# EAGLE design ssr8ch (EAGLE 9.3.0)
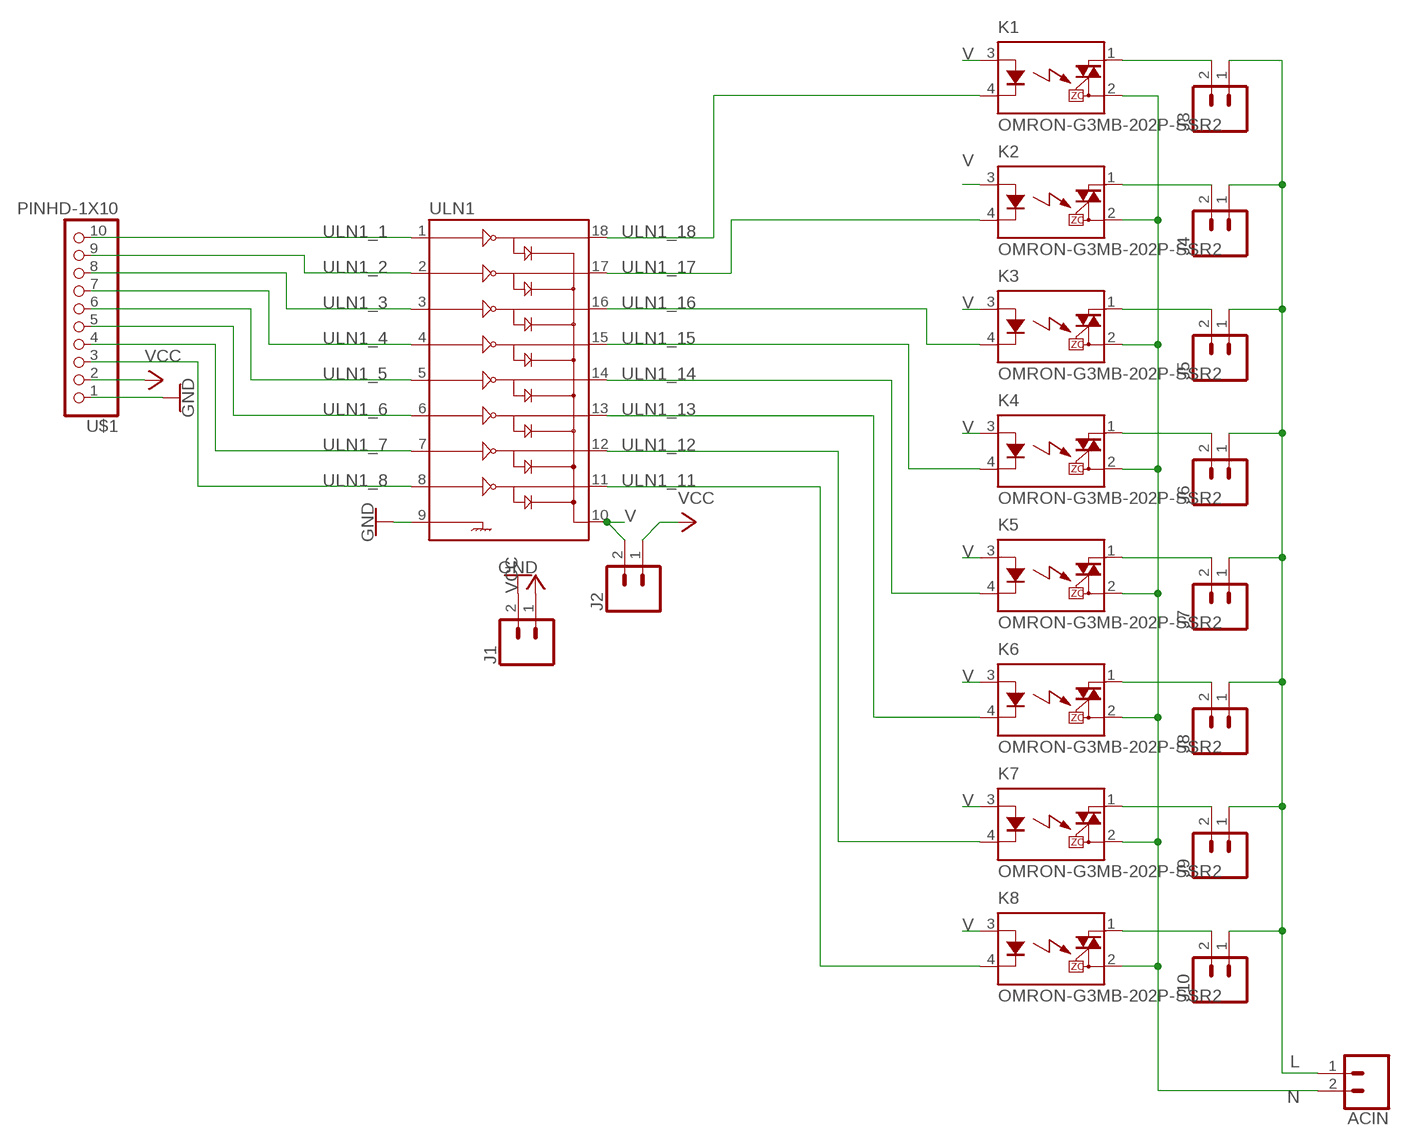
[diagram p0: schematic, sheet 1]

## Parts
ACIN  CONN_025MM  [SCREWTERMINAL-5MM-2]
J1  CONN_025MM  [SCREWTERMINAL-5MM-2]
J2  CONN_021X02_NO_SILK  [1X02_NO_SILK]
J3  CONN_025MM  [SCREWTERMINAL-5MM-2]
J4  CONN_025MM  [SCREWTERMINAL-5MM-2]
J5  CONN_025MM  [SCREWTERMINAL-5MM-2]
J6  CONN_025MM  [SCREWTERMINAL-5MM-2]
J7  CONN_025MM  [SCREWTERMINAL-5MM-2]
J8  CONN_025MM  [SCREWTERMINAL-5MM-2]
J9  CONN_025MM  [SCREWTERMINAL-5MM-2]
J10  CONN_025MM  [SCREWTERMINAL-5MM-2]
K1  OMRON-G3MB-202P-SSR2  [OMRON-G3MB-202P-SSR]
K2  OMRON-G3MB-202P-SSR2  [OMRON-G3MB-202P-SSR]
K3  OMRON-G3MB-202P-SSR2  [OMRON-G3MB-202P-SSR]
K4  OMRON-G3MB-202P-SSR2  [OMRON-G3MB-202P-SSR]
K5  OMRON-G3MB-202P-SSR2  [OMRON-G3MB-202P-SSR]
K6  OMRON-G3MB-202P-SSR2  [OMRON-G3MB-202P-SSR]
K7  OMRON-G3MB-202P-SSR2  [OMRON-G3MB-202P-SSR]
K8  OMRON-G3MB-202P-SSR2  [OMRON-G3MB-202P-SSR]
U$1  PINHD-1X10  [1X10-BIG]
ULN1  ULN2803DIP  [DIL18]

## Nets
GND: J1.2 U$1.1 ULN1.9
L: ACIN.1 J3.1 J4.1 J5.1 J6.1 J7.1 J8.1 J9.1 J10.1
N: ACIN.2 K1.2(DS2) K2.2(DS2) K3.2(DS2) K4.2(DS2) K5.2(DS2) K6.2(DS2) K7.2(DS2) K8.2(DS2)
N$2: J3.2 K1.1(DS1)
N$4: J5.2 K3.1(DS1)
N$5: J6.2 K4.1(DS1)
N$6: J7.2 K5.1(DS1)
N$7: J8.2 K6.1(DS1)
N$8: J9.2 K7.1(DS1)
N$9: J10.2 K8.1(DS1)
N$11: J4.2 K2.1(DS1)
ULN1_1: U$1.10 ULN1.1
ULN1_2: U$1.9 ULN1.2
ULN1_3: U$1.8 ULN1.3
ULN1_4: U$1.7 ULN1.4
ULN1_5: U$1.6 ULN1.5
ULN1_6: U$1.5 ULN1.6
ULN1_7: U$1.4 ULN1.7
ULN1_8: U$1.3 ULN1.8
ULN1_11: K8.4(K) ULN1.11
ULN1_12: K7.4(K) ULN1.12
ULN1_13: K6.4(K) ULN1.13
ULN1_14: K5.4(K) ULN1.14
ULN1_15: K4.4(K) ULN1.15
ULN1_16: K3.4(K) ULN1.16
ULN1_17: K2.4(K) ULN1.17
ULN1_18: K1.4(K) ULN1.18
V: J2.2 K1.3(A) K2.3(A) K3.3(A) K4.3(A) K5.3(A) K6.3(A) K7.3(A) K8.3(A) ULN1.10
VCC: J1.1 J2.1 U$1.2

## Library data of the parts
ACIN J1 J3-J10 = ssr8ch:CONN_02: Multi connection point. Often used as Generic Header-pin footprint for 0.1 inch spaced/style header connections On any of the 0.1 inch spaced packages, you can populate with these: Break Away Headers - Straight <https://www.sparkfun.com/products/116> (PRT-00116) Break Away Male Headers - Right Angle <https://www.sparkfun.com/products/553> (PRT-00553) Female Headers <https://www.sparkfun.com/products/115> (PRT-00115) Break Away Headers - Machine Pin <https://www.sparkfun.com/products/117> (PRT-00117) Break Away Female Headers - Swiss Machine Pin <https://www.sparkfun.com/products/743> (PRT-00743) For SCREWTERMINALS and SPRING TERMINALS visit here: Screw Terimnals on SparkFun.com <https://www.sparkfun.com/search/results?term=Screw+Terminals> (5mm/3.5mm/2.54mm spacing) This device is also useful as a general connection point to wire up your design to another part of your project. Our various solder wires solder well into these plated through hole pads. Hook-Up Wire - Assortment (Stranded, 22 AWG) <https://www.sparkfun.com/products/11375> (PRT-11375) Hook-Up Wire - Assortment (Solid Core, 22 AWG) <https://www.sparkfun.com/products/11367> (PRT-11367) View the entire wire category on our website here <https://www.sparkfun.com/categories/141> Special notes: Molex polarized connector foot print use with: PRT-08233 with associated crimp pins and housings. 2.54_SCREWTERM for use with PRT-10571. 3.5mm Screw Terminal footprints for PRT-08084 5mm Screw Terminal footprints for use with PRT-08432; SF_SKU: PRT-08432
J2 = ssr8ch:CONN_02: Multi connection point. Often used as Generic Header-pin footprint for 0.1 inch spaced/style header connections On any of the 0.1 inch spaced packages, you can populate with these: Break Away Headers - Straight <https://www.sparkfun.com/products/116> (PRT-00116) Break Away Male Headers - Right Angle <https://www.sparkfun.com/products/553> (PRT-00553) Female Headers <https://www.sparkfun.com/products/115> (PRT-00115) Break Away Headers - Machine Pin <https://www.sparkfun.com/products/117> (PRT-00117) Break Away Female Headers - Swiss Machine Pin <https://www.sparkfun.com/products/743> (PRT-00743) For SCREWTERMINALS and SPRING TERMINALS visit here: Screw Terimnals on SparkFun.com <https://www.sparkfun.com/search/results?term=Screw+Terminals> (5mm/3.5mm/2.54mm spacing) This device is also useful as a general connection point to wire up your design to another part of your project. Our various solder wires solder well into these plated through hole pads. Hook-Up Wire - Assortment (Stranded, 22 AWG) <https://www.sparkfun.com/products/11375> (PRT-11375) Hook-Up Wire - Assortment (Solid Core, 22 AWG) <https://www.sparkfun.com/products/11367> (PRT-11367) View the entire wire category on our website here <https://www.sparkfun.com/categories/141> Special notes: Molex polarized connector foot print use with: PRT-08233 with associated crimp pins and housings. 2.54_SCREWTERM for use with PRT-10571. 3.5mm Screw Terminal footprints for PRT-08084 5mm Screw Terminal footprints for use with PRT-08432
K1-K8 = ssr8ch:OMRON-G3MB-202P-SSR: IT(rms) 8A, Zero Cross type SIP 4pin Triac output SSR Source: http://sharp-world.com/products/device/lineup/data/pdf/datasheet/s102s02_e.pdf; MPN: S202S02F; OC_FARNELL: 1618475; OC_NEWARK: 14N9588
U$1 = ssr8ch:PINHD-1X10: Pin header 1x10 0.1" spacing With round pins
ULN1 = ssr8ch:ULN2803: Darlington Driver(IC-07959, low stock) ULN2803 Darlington array. 500mA max per channel, 8-channel package. Spark Fun Electronics SKU : COM-00312

## Net classes
0 default: clearance 0.9 mm

## Board
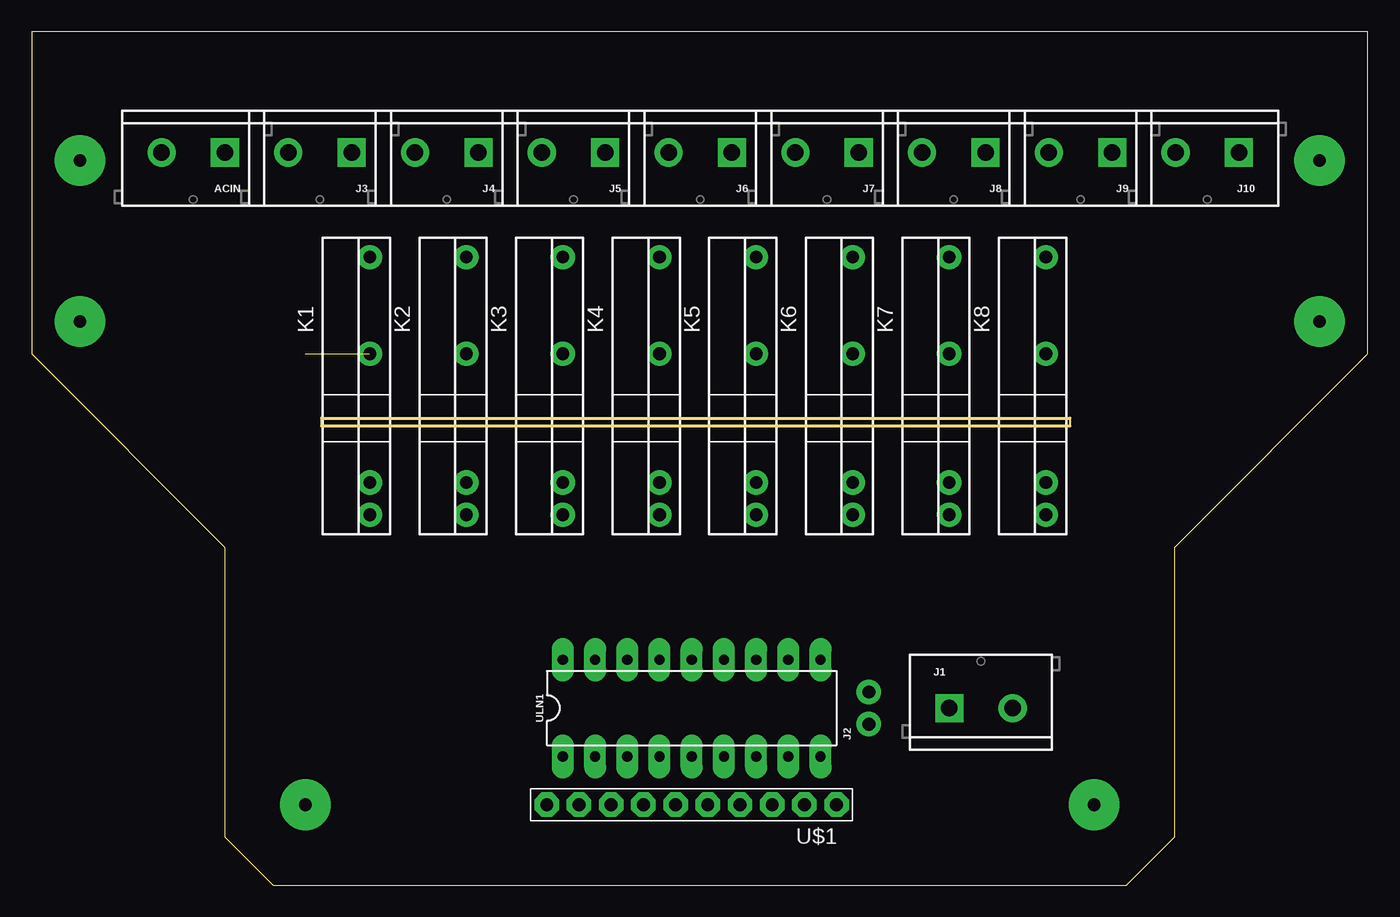
[diagram p1: board, top side]
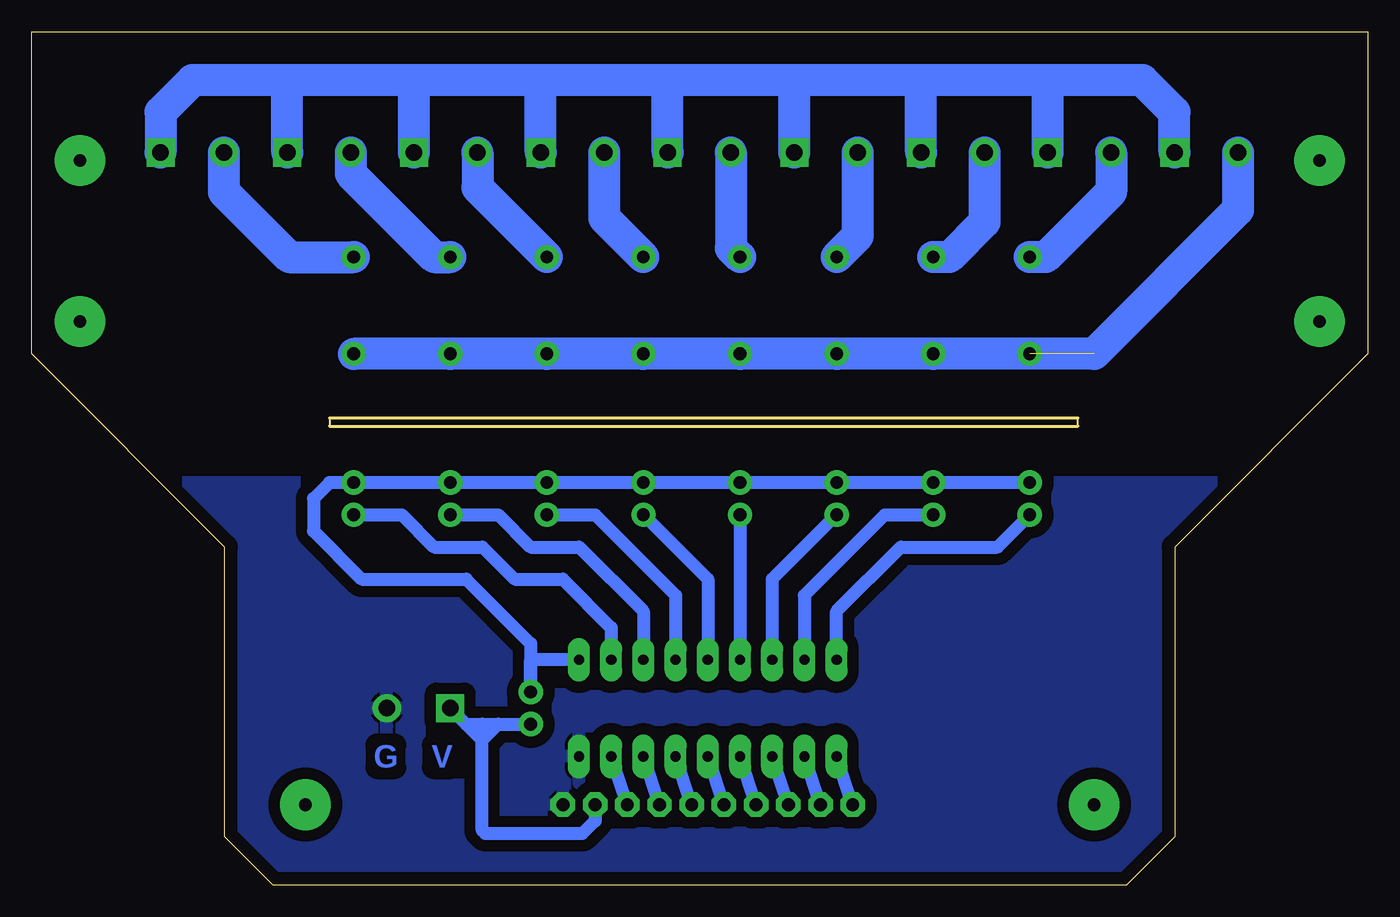
[diagram p2: board, bottom side, seen from below]

Size 105.41 x 67.31 mm. Coordinates in mm from the lower left corner, seen from the top.
Outline: 0,67.31 0,41.91 15.24,26.67 15.24,3.81 19.05,0 86.36,0 90.17,3.81 90.17,26.67 105.41,41.91 105.41,67.31 0,67.31
Outline: 22.86,36.83 81.91,36.83 81.91,36.2 22.86,36.2 22.86,36.83
Copper layers (1*16): Top 0.035mm / dielectric 1.5mm / Bottom 0.035mm
Design rules "default *": minimum track width 6mil, minimum drill 0.35mm, track to track 6mil, track to pad 6mil, pad to pad 6mil, via to via 6mil, smd to smd 6mil, copper to edge 40mil, drill to drill 6mil, minimum pad ring 18mil, minimum via ring 8mil, stop-mask expansion 4mil, vias tented up to drill 0mil, thermal gap 10mil

### Footprints (pad centres in the part's own frame; a part is rotated, then mirrored left to right if it is on the bottom)
SCREWTERMINAL-5MM-2 = drill 1.3 pad 2.032 square: 1 0,0 | drill 1.3 pad 2.032: 2 5,0
1X02_NO_SILK = drill 1.016 pad 1.88: 1 0,0; 2 2.54,0
OMRON-G3MB-202P-SSR = drill 1: 1 -12.7,0; 2 -5.08,0; 3 5.08,0; 4 7.62,0
1X10-BIG = drill 1.016 pad 1.778 octagon: 1 -11.43,0; 2 -8.89,0; 3 -6.35,0; 4 -3.81,0; 5 -1.27,0; 6 1.27,0; 7 3.81,0; 8 6.35,0; 9 8.89,0; 10 11.43,0
DIL18 = drill 0.813 long: 1 -10.16,-3.81; 2 -7.62,-3.81; 3 -5.08,-3.81; 4 -2.54,-3.81; 5 0,-3.81; 6 2.54,-3.81; 7 5.08,-3.81; 8 7.62,-3.81; 9 10.16,-3.81; 10 10.16,3.81; 11 7.62,3.81; 12 5.08,3.81; 13 2.54,3.81; 14 0,3.81; 15 -2.54,3.81; 16 -5.08,3.81; 17 -7.62,3.81; 18 -10.16,3.81

### Placement (x,y rotation side)
ACIN  15.25,57.78 180 top
J1  72.39,13.97 0 top
J2  66.04,12.7 90 top
J3  25.25,57.78 180 top
J4  35.25,57.78 180 top
J5  45.25,57.78 180 top
J6  55.24,57.78 180 top
J7  65.25,57.78 180 top
J8  75.25,57.78 180 top
J9  85.25,57.78 180 top
J10  95.25,57.78 180 top
K1  26.67,36.83 270 top
K2  34.29,36.83 270 top
K3  41.91,36.83 270 top
K4  49.53,36.83 270 top
K5  57.15,36.83 270 top
K6  64.77,36.83 270 top
K7  72.39,36.83 270 top
K8  80.01,36.83 270 top
U$1  52.07,6.35 180 top
ULN1  52.07,13.97 0 top

### Tracks (layer width: path | path; a pad name or v marks a point on that pad's centre or on a via)
GND
  pour Bottom (isolate 0.254): 3.81,31.75 104.14,31.75 104.14,-3.81 3.81,-3.81
L
  Bottom 2.54: 25.4,63.5 17.78,63.5 15.25,60.96 ACIN.1 | 25.4,63.5 35.56,63.5 | 35.56,63.5 45.72,63.5 | 45.72,63.5 55.88,63.5 | 55.88,63.5 64.77,63.5 | 64.77,63.5 74.93,63.5 | 74.93,63.5 85.09,63.5 | 85.09,63.5 92.71,63.5 95.25,60.96 J10.1 | J9.1 85.25,63.34 85.09,63.5 | J8.1 75.25,63.19 74.93,63.5 | J7.1 65.25,63.02 64.77,63.5 | J6.1 55.24,62.87 55.88,63.5 | J5.1 45.25,63.02 45.72,63.5 | J4.1 35.25,63.19 35.56,63.5 | J3.1 25.25,63.34 25.4,63.5
N  (1 unrouted)
  Bottom 2.54: K8.2 K7.2 K6.2 K5.2 K4.2 K3.2 K2.2 21.59,41.91 10.25,53.26 ACIN.2
N$1  (via drill 1 pad 4)
  other vias: 3.81,44.45
N$2
  Bottom 2.54: J3.2 20.25,54.69 25.4,49.53 K1.1
N$3  (via drill 1 pad 4)
  other vias: 101.6,44.45
N$4
  Bottom 2.54: J5.2 40.25,51.2 K3.1
N$5
  Bottom 2.54: J6.2 50.25,50.24 K4.1
N$6
  Bottom 2.54: J7.2 60.24,52.62 K5.1
N$7
  Bottom 2.54: J8.2 70.25,55.01 K6.1
N$8
  Bottom 2.54: J9.2 80.25,56.12 73.66,49.53 K7.1
N$9
  Bottom 2.54: J10.2 90.25,54.69 85.09,49.53 K8.1
N$10  (via drill 1 pad 4)
  other vias: 21.59,6.35
N$11
  Bottom 2.54: J4.2 30.25,52.3 33.02,49.53 K2.1
N$13  (via drill 1 pad 4)
  other vias: 83.82,6.35
N$14  (via drill 1 pad 4)
  other vias: 101.6,57.15
N$15  (via drill 1 pad 4)
  other vias: 3.81,57.15
ULN1_1
  Bottom 1.016: U$1.10 ULN1.1
ULN1_2
  Bottom 1.016: U$1.9 ULN1.2
ULN1_3
  Bottom 1.016: U$1.8 ULN1.3
ULN1_4
  Bottom 1.016: U$1.7 ULN1.4
ULN1_5
  Bottom 1.016: U$1.6 ULN1.5
ULN1_6
  Bottom 1.016: U$1.5 ULN1.6
ULN1_7
  Bottom 1.016: U$1.4 ULN1.7
ULN1_8
  Bottom 1.016: U$1.3 ULN1.8
ULN1_11
  Bottom 1.016: K8.4 76.2,29.21 73.66,26.67 69.85,26.67 67.31,24.13 63.5,24.13 59.69,20.32 ULN1.11
ULN1_12
  Bottom 1.016: K7.4 68.58,29.21 66.04,26.67 62.23,26.67 57.15,21.59 ULN1.12
ULN1_13
  Bottom 1.016: K6.4 60.96,29.21 54.61,22.86 ULN1.13
ULN1_14
  Bottom 1.016: K5.4 52.07,24.13 ULN1.14
ULN1_15
  Bottom 1.016: K4.4 ULN1.15
ULN1_16
  Bottom 1.016: K3.4 46.99,24.13 ULN1.16
ULN1_17
  Bottom 1.016: K2.4 38.1,29.21 44.45,22.86 ULN1.17
ULN1_18
  Bottom 1.016: ULN1.18 41.91,21.59 36.83,26.67 29.21,26.67 K1.4
V
  Bottom 1.016: ULN1.10 66.04,17.78 J2.2 66.04,19.05 71.12,24.13 79.38,24.13 83.19,27.94 83.19,30.48 81.91,31.75 K8.3 K7.3 K6.3 K5.3 K4.3 K3.3 K2.3 K1.3
VCC
  Bottom 1.016: J1.1 71.12,12.7 | 71.12,12.7 69.87,12.7 | 69.87,12.7 68.6,12.7 | J2.1 68.58,12.7 68.6,12.7 | U$1.2 60.96,5.08 61.98,4.06 69.6,4.06 69.87,4.33 69.87,11.43 | 69.87,11.43 69.87,12.7 | 71.12,12.7 71.12,12.68 69.87,11.43 | 69.87,11.43 68.6,12.7

### Text on the board
Bottom: V | G